# Altium schematic sheet Microcontroller.SchDoc
size A4
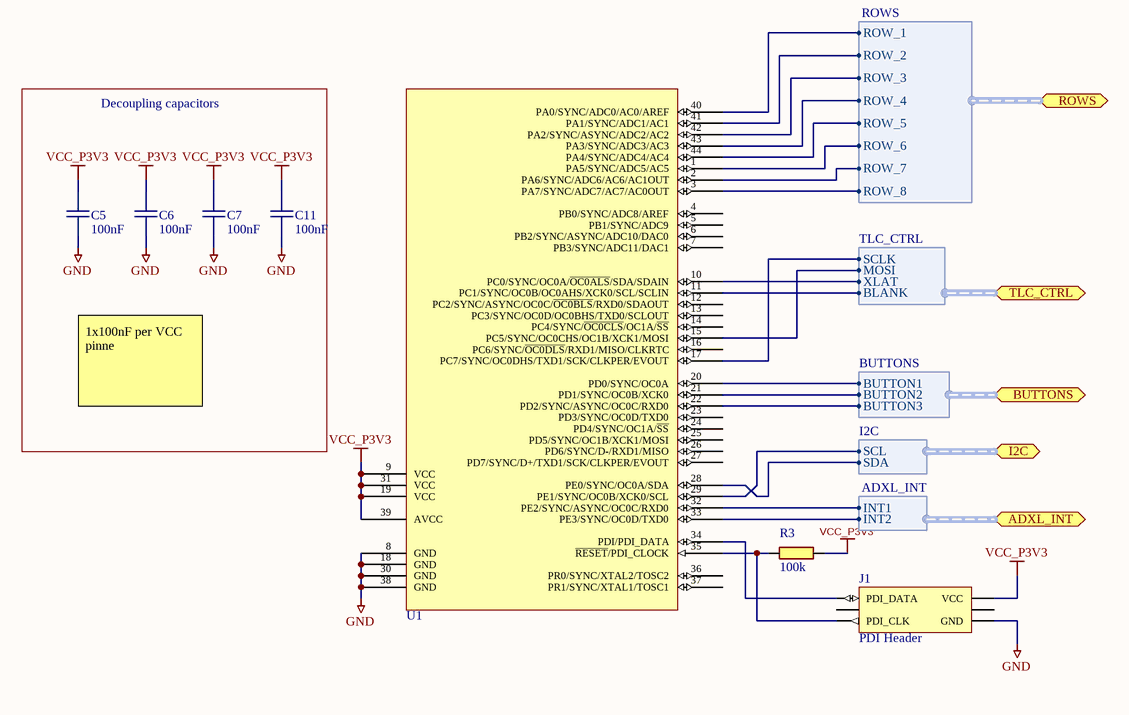
[diagram p0: Microcontroller.SchDoc]

## Parts
C5  100nF  [CAPC0805(2012)100_N]
C6  100nF  [CAPC0805(2012)100_N]
C7  100nF  [CAPC0805(2012)100_N]
C11  100nF  [CAPC0805(2012)100_N]
J1  PDI Header  [HEADER_3x2]
R3  100k  [RESC0603(1608)_N]
U1  ATXMEGA-A4U  [TQFP80P1200X1200X120-44N]  (value not drawn)

## Blocks framed on the sheet
Decoupling capacitors: C5-C7 C11

## Ports
ADXL_INT (harness ADXL_INT), BUTTONS (harness BUTTONS), I2C (harness I2C), ROWS (harness ROWS), TLC_CTRL (harness TLC_CTRL)

## Harnesses
ROWS: ROW_1, ROW_2, ROW_3, ROW_4, ROW_5, ROW_6, ROW_7, ROW_8
TLC_CTRL: SCLK, MOSI, XLAT, BLANK
I2C: SCL, SDA
ADXL_INT: INT1, INT2
BUTTONS: BUTTON1, BUTTON2, BUTTON3

## Nets
GND: C5.1 C6.1 C7.1 C11.1 J1.6(GND) U1.8(GND) U1.18(GND) U1.30(GND) U1.38(GND)
VCC_P3V3: C5.2 C6.2 C7.2 C11.2 J1.2(VCC) R3.1 U1.9(VCC) U1.19(VCC) U1.31(VCC) U1.39(AVCC)
NetJ1_1: J1.1(PDI_DATA) U1.34(PDI/PDI_DATA)
NetJ1_5: J1.5(PDI_CLK) R3.2 U1.35(~{RESET}/PDI_CLOCK)
NetU1_1: U1.1(PA5/SYNC/ADC5/AC5) ; port ROWS.ROW_6
NetU1_2: U1.2(PA6/SYNC/ADC6/AC6/AC1OUT) ; port ROWS.ROW_7
NetU1_3: U1.3(PA7/SYNC/ADC7/AC7/AC0OUT) ; port ROWS.ROW_8
NetU1_10: U1.10(PC0/SYNC/OC0A/~{OC0ALS}/SDA/SDAIN) ; port TLC_CTRL.XLAT
NetU1_11: U1.11(PC1/SYNC/OC0B/OC0AHS/XCK0/SCL/SCLIN) ; port TLC_CTRL.BLANK
NetU1_15: U1.15(PC5/SYNC/OC0CHS/OC1B/XCK1/MOSI) ; port TLC_CTRL.MOSI
NetU1_17: U1.17(PC7/SYNC/OC0DHS/TXD1/SCK/CLKPER/EVOUT) ; port TLC_CTRL.SCLK
NetU1_20: U1.20(PD0/SYNC/OC0A) ; port BUTTONS.BUTTON1
NetU1_21: U1.21(PD1/SYNC/OC0B/XCK0) ; port BUTTONS.BUTTON2
NetU1_22: U1.22(PD2/SYNC/ASYNC/OC0C/RXD0) ; port BUTTONS.BUTTON3
NetU1_28: U1.28(PE0/SYNC/OC0A/SDA) ; port I2C.SDA
NetU1_29: U1.29(PE1/SYNC/OC0B/XCK0/SCL) ; port I2C.SCL
NetU1_32: U1.32(PE2/SYNC/ASYNC/OC0C/RXD0) ; port ADXL_INT.INT1
NetU1_33: U1.33(PE3/SYNC/OC0D/TXD0) ; port ADXL_INT.INT2
NetU1_40: U1.40(PA0/SYNC/ADC0/AC0/AREF) ; port ROWS.ROW_1
NetU1_41: U1.41(PA1/SYNC/ADC1/AC1) ; port ROWS.ROW_2
NetU1_42: U1.42(PA2/SYNC/ASYNC/ADC2/AC2) ; port ROWS.ROW_3
NetU1_43: U1.43(PA3/SYNC/ADC3/AC3) ; port ROWS.ROW_4
NetU1_44: U1.44(PA4/SYNC/ADC4/AC4) ; port ROWS.ROW_5

Not connected (* = marked no-connect by the designer): J1 3 4; U1 4(PB0/SYNC/ADC8/AREF) 5(PB1/SYNC/ADC9) 6(PB2/SYNC/ASYNC/ADC10/DAC0) 7(PB3/SYNC/ADC11/DAC1) 12(PC2/SYNC/ASYNC/OC0C/~{OC0BLS}/RXD0/SDAOUT) 13(PC3/SYNC/OC0D/OC0BHS/TXD0/SCLOUT) 14(PC4/SYNC/~{OC0CLS}/OC1A/~{SS}) 16(PC6/SYNC/~{OC0DLS}/RXD1/MISO/CLKRTC) 23(PD3/SYNC/OC0D/TXD0) 24(PD4/SYNC/OC1A/~{SS}) 25(PD5/SYNC/OC1B/XCK1/MOSI) 26(PD6/SYNC/D-/RXD1/MISO) 27(PD7/SYNC/D+/TXD1/SCK/CLKPER/EVOUT) 36(PR0/SYNC/XTAL2/TOSC2) 37(PR1/SYNC/XTAL1/TOSC1)

## Notes on the sheet
- 1x100nF per VCC pinne

## Library data of the parts
C5-C7 C11 = 2445: X7R 50V; id: 2445; rad: 1; rom: OV; lager_type: Fremlager; dybde: 4; hylle: 13; antall: 50; kolonne: 3; pakke_opprettet_av: 815; leverandor_varenr: 2408556; nokkelord: Kondensator, capacitor; produsent: Multikomp; leverandor: Farnell; pakketype: 0805; pakke_opprettet: 11/14/2014 8:52:01 PM; symbol_opprettet_av: 815; symbol_opprettet: 11/14/2014 8:19:34 PM; navn: 100nF; pris: 1
J1 = 2407: PDI Xmega programming header; id: 2407
R3 = 2384: 0.1W 1% Thick film resistor; id: 2384; rad: -1; rom: OV; lager_type: Fremlager; dybde: 96; hylle: 6; antall: 100; kolonne: 0; pakke_opprettet_av: 815; pakketype: 0603; pakke_opprettet: 08.07.2014 21:15:30; symbol_opprettet_av: 815; symbol_opprettet: 08.07.2014 21:16:33; navn: 100k; pris: 0; nokkelord: Resistor
U1 = 2103: id: 2103; rad: 4; rom: OV; lager_type: Fremlager; dybde: 0; antall: 82; kolonne: 2; pakke_opprettet_av: 774; beskrivelse: Mikrokontroller; navn: ATXMEGA64A4U-AU; produsent: Atmel; pakketype: TQFP; hylle: 0; pakke_opprettet: 8/22/2014 2:00:28 PM; symbol_opprettet_av: 774; symbol_opprettet: 8/22/2014 2:00:55 PM; pris: 0